# EAGLE design bbf-supply (EAGLE 9.7.0)
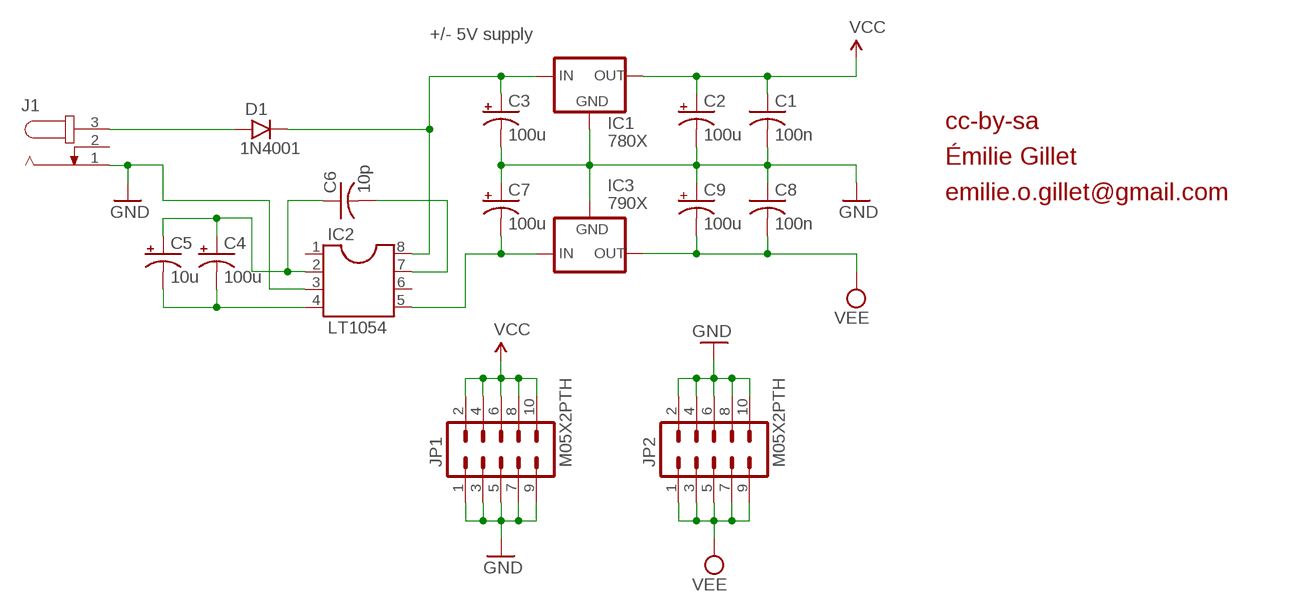
[diagram p0: schematic, sheet 1]

## Parts
C1  100n  C-US025-025X050  [C025-025X050]
C2  100u  CPOL-USE2.5-7  [E2,5-7]
C3  100u  CPOL-USE2.5-7  [E2,5-7]
C4  100u  CPOL-USE2.5-6  [E2,5-6]
C5  10u  CPOL-USE2.5-5  [E2,5-5]
C6  10p  C-US025-025X050  [C025-025X050]
C7  100u  CPOL-USE2.5-7  [E2,5-7]
C8  100n  C-US025-025X050  [C025-025X050]
C9  100u  CPOL-USE2.5-7  [E2,5-7]
D1  1N4001  1N400X.3  [DO41-3]
IC1  780X  78XXS  [78XXS]
IC2  LT1054  DIL8  [DIL08]
IC3  790X  79XXS  [79XXS]
J1  JACK-PLUG2  [SPC4078_BIG_HOLES]
JP1  M05X2PTH  [AVR_ICSP]
JP2  M05X2PTH  [AVR_ICSP]

## Nets
GND: C1.2 C2.- C3.- C7.+ C8.1 C9.+ IC1.GND IC2.3 IC3.GND J1.1 JP1.1 JP1.3 JP1.5 JP1.7 JP1.9 JP2.2 JP2.4 JP2.6 JP2.8 JP2.10
N$44: D1.A J1.3
N$46: C3.+ D1.C IC1.IN IC2.8
N$47: C4.+ C5.+ C6.1 IC2.2
N$48: C4.- C5.- IC2.4
N$49: C6.2 IC2.7
N$58: C7.- IC2.5 IC3.IN
VCC: C1.1 C2.+ IC1.OUT JP1.2 JP1.4 JP1.6 JP1.8 JP1.10
VEE: C8.2 C9.- IC3.OUT JP2.1 JP2.3 JP2.5 JP2.7 JP2.9
Unconnected: IC2.1 IC2.6 J1.2

## Notes on the sheet
- +/- 5V supply
- cc-by-sa
- Émilie Gillet
- emilie.o.gillet@gmail.com

## Library data of the parts
C1 C6 C8 = rcl:C-US: CAPACITOR, American symbol
C2-C5 C7 C9 = rcl:CPOL-US: POLARIZED CAPACITOR, American symbol
D1 = gm-diodes:1N400X: Rectifier Diodes often used in power supply to prevent damage from reverse polarization
IC1 = v-reg:78XXS: VOLTAGE REGULATOR
IC2 = ic-package:DIL8: Dual In Line / Socket
IC3 = v-reg:79XXS: VOLTAGE REGULATOR
J1 = con-jack2:JACK-PLUG: DC POWER JACK Power Jack, DC, Right Angle, Through Hole, Rated 5A at 16VDC, PC Terminals Distributor: Farnell (www.Farnell.de) Drawing: 84N1161.pdf / 84N1162.pdf Manufacturer: SPC Technology (www.spctechnology.com) Type: SPC4077 / SPC 4078
JP1 JP2 = SparkFun:M05X2: Header 5x2 Standard 10-pin dual row 0.1" header. Commonly used with AVR-ISP. Use with Spark Fun Electronics SKU: PRT-00778

## Board
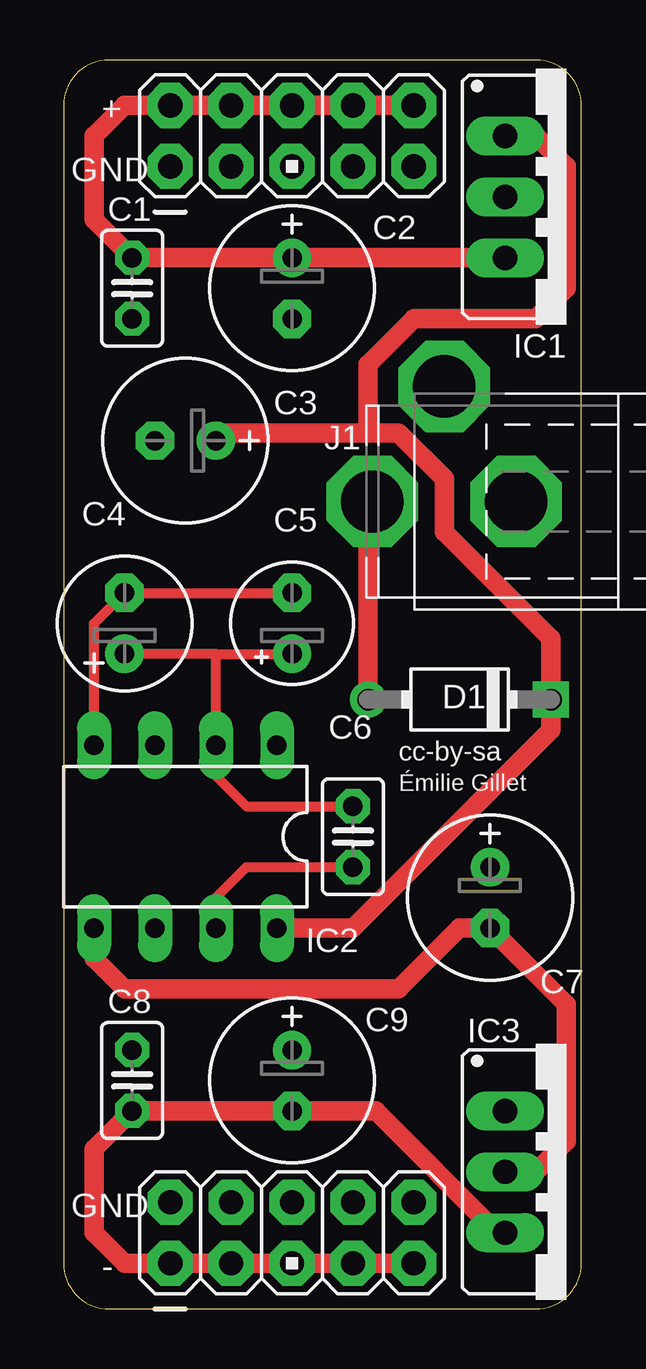
[diagram p1: board, top side]
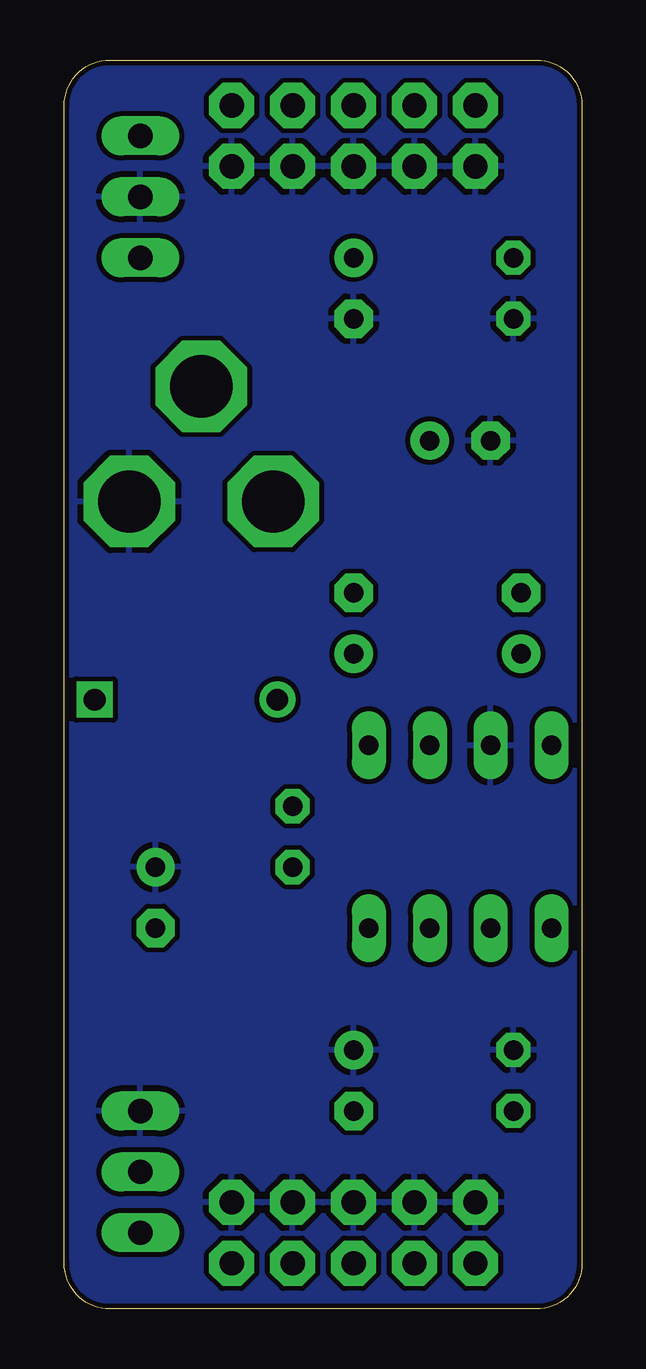
[diagram p2: board, bottom side, seen from below]

Size 21.59 x 52.06 mm. Coordinates in mm from the lower left corner, seen from the top.
Outline: 1.89,52.06 arc90 0,50.16 0,1.91 arc90 1.91,0 19.68,0 arc90 21.59,1.91 21.59,50.16 arc90 19.7,52.06 1.89,52.06
Copper layers (1*16): Top 0.035mm / dielectric 1.5mm / Bottom 0.035mm
Design rules "SparkFun_10mil *": minimum track width 8mil, minimum drill 20mil, track to track 8mil, track to pad 8mil, pad to pad 8mil, via to via 8mil, smd to smd 8mil, copper to edge 8mil, drill to drill 8mil, minimum pad ring 12mil, minimum via ring 10mil, stop-mask expansion 4mil, vias tented up to drill 25mil, thermal gap 10mil

### Footprints (pad centres in the part's own frame; a part is rotated, then mirrored left to right if it is on the bottom)
C025-025X050 = drill 0.813 octagon: 1 -1.27,0; 2 1.27,0
E2,5-7 = drill 0.813 pad 1.6: + -1.27,0 | drill 0.813 pad 1.6 octagon: - 1.27,0
E2,5-6 = drill 0.813 pad 1.6: + -1.27,0 | drill 0.813 pad 1.6 octagon: - 1.27,0
E2,5-5 = drill 0.813 pad 1.6: + -1.27,0 | drill 0.813 pad 1.6 octagon: - 1.27,0
DO41-3 = drill 0.9: A 3.81,0 | drill 0.9 square: C -3.81,0
78XXS = drill 1.016 long: GND 0,-2.54; IN -2.54,-2.54; OUT 2.54,-2.54
DIL08 = drill 0.813 long: 1 -3.81,-3.81; 2 -1.27,-3.81; 3 1.27,-3.81; 4 3.81,-3.81; 5 3.81,3.81; 6 1.27,3.81; 7 -1.27,3.81; 8 -3.81,3.81
79XXS = drill 1.016 long: GND -2.54,-2.54; IN 0,-2.54; OUT 2.54,-2.54
SPC4078_BIG_HOLES = drill 2.6 pad 3.81 octagon: 1 -0.46,0; 2 2.54,-4.8; 3 5.54,0
AVR_ICSP = drill 1.016 pad 1.88 octagon: 1 -1.27,5.08; 2 1.27,5.08; 3 -1.27,2.54; 4 1.27,2.54; 5 -1.27,0; 6 1.27,0; 7 -1.27,-2.54; 8 1.27,-2.54; 9 -1.27,-5.08; 10 1.27,-5.08

### Placement (x,y rotation side)
C1  2.86,42.55 270 top
C2  9.53,42.55 270 top
C3  5.08,36.2 180 top
C4  2.54,28.58 90 top
C5  9.53,28.58 90 top
C6  12.06,19.69 270 top
C7  17.78,17.15 270 top
C8  2.86,9.52 270 top
C9  9.53,9.52 270 top
D1  16.51,25.4 180 top
IC1  20.95,46.35 270 top
IC2  5.08,19.69 180 top
IC3  20.95,5.72 270 top
J1  18.41,33.66 180 top
JP1  9.53,48.9 90 top
JP2  9.53,3.18 90 top

### Tracks (layer width: path | path; a pad name or v marks a point on that pad's centre or on a via)
GND
  pour Bottom: 1.91,52.07 arc90 0,50.16 0,1.91 arc90 1.91,0 19.68,0 arc90 21.59,1.91 21.59,50.16 arc90 19.68,52.07
N$44
  Top 0.813: D1.A 12.7,32.38 12.88,32.56 J1.3
N$46
  Top 0.813: 12.7,36.51 6.67,36.51 C3.+ | 12.7,36.51 13.97,36.51 15.88,34.61 15.88,32.38 20.32,27.94 D1.C 20.32,24.13 12.06,15.88 IC2.8 | IC1.IN 19.68,48.9 20.95,47.63 20.95,42.55 19.68,41.27 14.61,41.27 12.7,39.37 12.7,36.51
N$47
  Top 0.406: 6.35,27.3 C4.+ | 6.35,27.3 C5.+ | 6.35,27.3 IC2.2 6.35,22.23 7.62,20.96 C6.1
N$48
  Top 0.406: C5.- C4.- 1.27,28.58 IC2.4
N$49
  Top 0.406: IC2.7 6.35,17.15 7.62,18.41 C6.2
N$58
  Top 0.813: IC2.5 1.27,14.61 2.54,13.34 13.97,13.34 16.51,15.88 C7.- 20.95,12.7 20.95,6.98 19.68,5.72 IC3.IN
VCC
  Top 0.813: IC1.OUT C2.+ C1.1 1.27,45.4 1.27,48.9 2.54,50.16 JP1.2 JP1.4 JP1.6 JP1.8 JP1.10
VEE
  Top 0.813: JP2.9 JP2.7 JP2.5 JP2.3 JP2.1 2.54,1.91 1.27,3.18 1.27,6.67 C8.2 C9.- 13.02,8.26 18.1,3.18 IC3.OUT

### Text on the board
tNames: + | GND | cc-by-sa | Émilie Gillet | GND | -